# EAGLE design 1ssrCompactBoard (EAGLE 7.5.0)
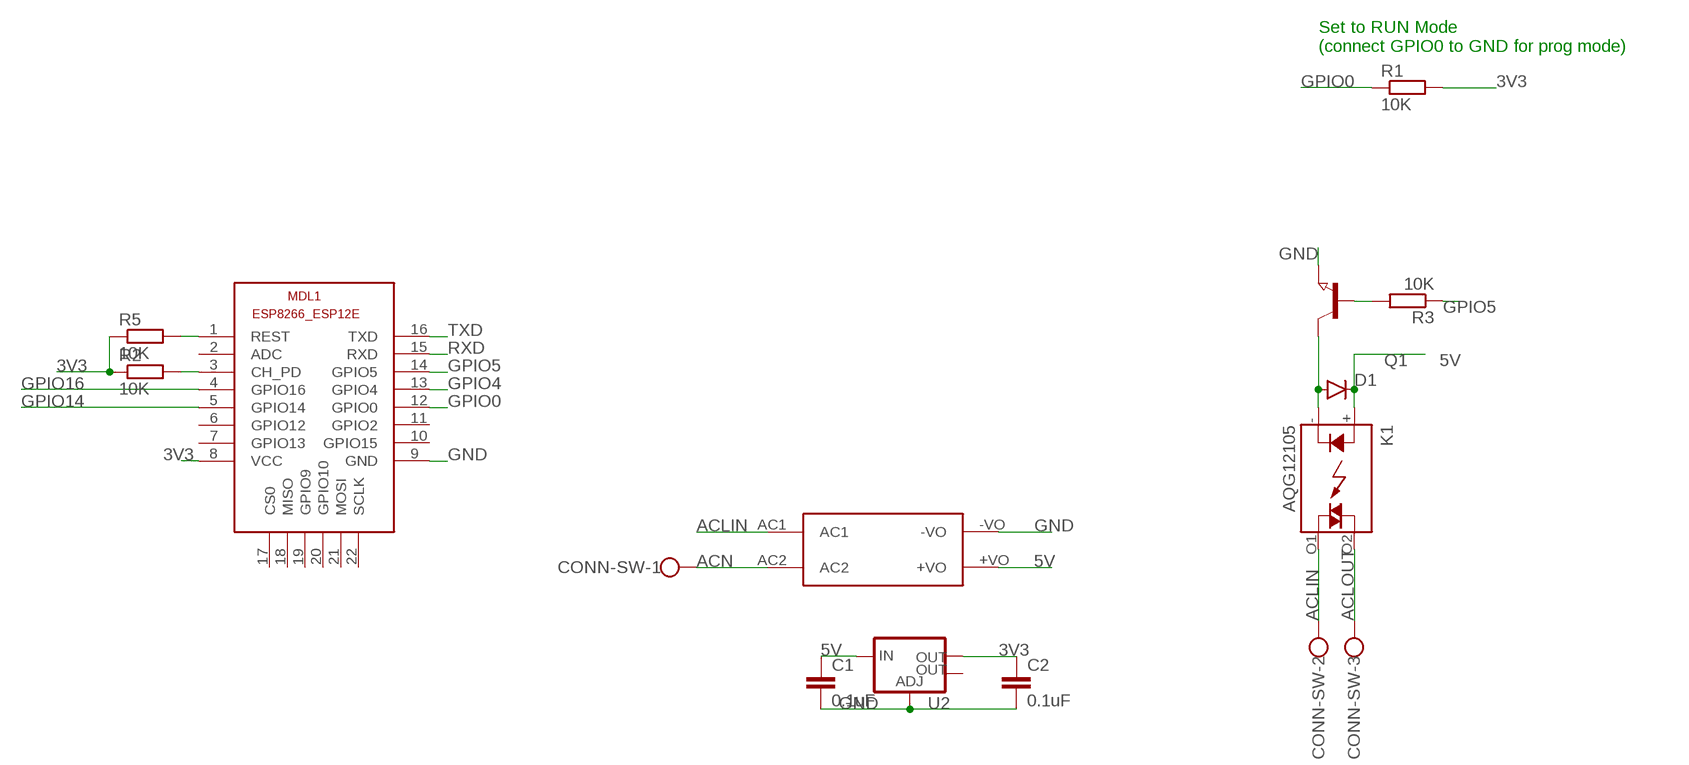
[diagram p0: schematic, sheet 1]

## Parts
C1  0.1uF  0.1UF-25V-5%(0603)  [0603-CAP]
C2  0.1uF  0.1UF-25V-5%(0603)  [0603-CAP]
CONN-SW  W237-103  [W237-103]
D1  DIODESMA  [SMA-DIODE]
K1  AQG12105  [AQG]
MDL1  ESP8266-12EESP8266-ESP12E  [ESP8266-ESP12E]
Q1  NPN-TRANSISTOR_SOT23  [SOT23]
R1  10K  R-EU_R0805  [R0805]
R2  10K  R-EU_R0805  [R0805]
R3  10K  R-EU_R0805  [R0805]
R5  10K  R-EU_R0805  [R0805]
U2  V_REG_LM1117SOT223  [SOT223]
U$4  HLK-PM01  [HLK-PM01]

## Nets
3V3: C2.1 MDL1.8(VCC) R1.2 R2.1 R5.1 U2.2(OUT)
5V: C1.1 D1.C K1.+(A) U2.3(IN) U$4.+VO
ACLIN [ac]: CONN-SW.2 K1.O1(DS2) U$4.AC1
ACLOUT [ac]: CONN-SW.3 K1.O2(DS1)
ACN [ac]: CONN-SW.1 U$4.AC2
GND: C1.2 C2.2 MDL1.9(GND) Q1.2(E) U2.1(ADJ) U$4.-VO
GPIO0: MDL1.12(GPIO0) R1.1
GPIO4: MDL1.13(GPIO4)
GPIO5: MDL1.14(GPIO5) R3.1
GPIO14: MDL1.5(GPIO14)
GPIO16: MDL1.4(GPIO16)
N$6: MDL1.1(REST) R5.2
N$9: MDL1.3(CH_PD) R2.2
N$10: D1.A K1.-(K) Q1.3(C)
N$12: Q1.1(B) R3.2
RXD: MDL1.15(RXD)
TXD: MDL1.16(TXD)
Unconnected: MDL1.2(ADC) MDL1.6(GPIO12) MDL1.7(GPIO13) MDL1.10(GPIO15) MDL1.11(GPIO2) MDL1.17(CS0) MDL1.18(MISO) MDL1.19(GPIO9) MDL1.20(GPIO10) MDL1.21(MOSI) MDL1.22(SCLK) U2.4(OUT)

## Notes on the sheet
- Set to RUN Mode
  (connect GPIO0 to GND for prog mode)

## Library data of the parts
C1 C2 = SparkFun-Capacitors:0.1UF-25V-5%(0603): CAP-08604; PROD_ID: CAP-08604
CONN-SW = con-wago-500:W237-103: WAGO SCREW CLAMP; MPN: 237-103; OC_FARNELL: unknown; OC_NEWARK: 18M7116
D1 = SparkFun-DiscreteSemi:DIODE: Diode These are standard reverse protection diodes and small signal diodes. SMA package can handle up to about 1A. SOD-323 can handle about 200mA. What the SOD-323 package when ordering, there are some mfgs out there that are 5-pin packages.
K1 = relay:AQG*: SOLID STATE RELAY NAiS Zero-cross, Non zero-cross Source: http://www.mew-europe.com/.. en_ds_61611_0000.pdf; MF: AROMAT/ MATSUSHITA; MPN: AQG12105; OC_FARNELL: unknown; OC_NEWARK: 20J4759
MDL1 = ESP8266-ESP12E:ESP8266-12E: ESP8266-12E with additional I/O and GPIO04/05 corrected The author cannot warrant that this library is free from error or will meet your specific requirements. Created by PuceBaboon.com. Komagane, Nagano, JAPAN
Q1 = semicon-smd-ipc:NPN-TRANSISTOR_: NPN TRANSISTOR
R1-R3 R5 = resistor:R-EU_: RESISTOR, European symbol
U2 = SparkFun-PowerIC:V_REG_LM1117: Voltage Regulator LM1117 Standard adjustable voltage regulator but in SMD form. Spark Fun Electronics SKU : COM-00595; PROD_ID: VREG-08170
U$4 = hlk-pm01:HLK-PM01

## Net classes
0 default: width 0.152 mm, drill 0.305 mm, clearance 0.152 mm
1 ac: width 1.27 mm, drill 1.27 mm, clearance 2.54 mm

## Board
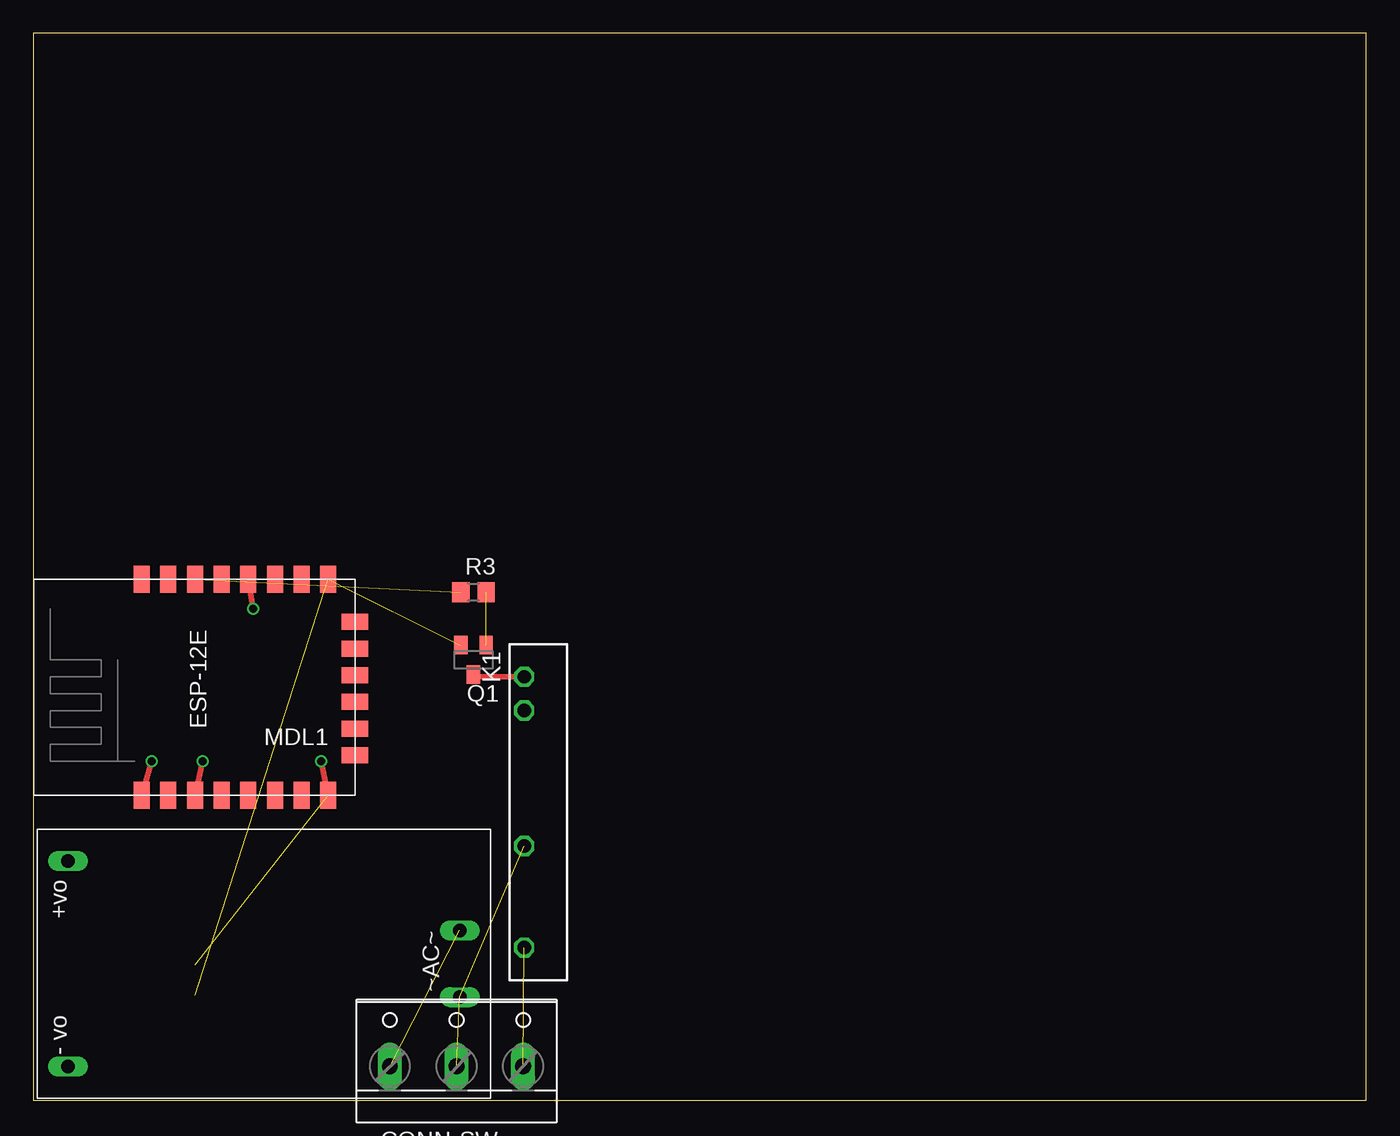
[diagram p1: board, top side]
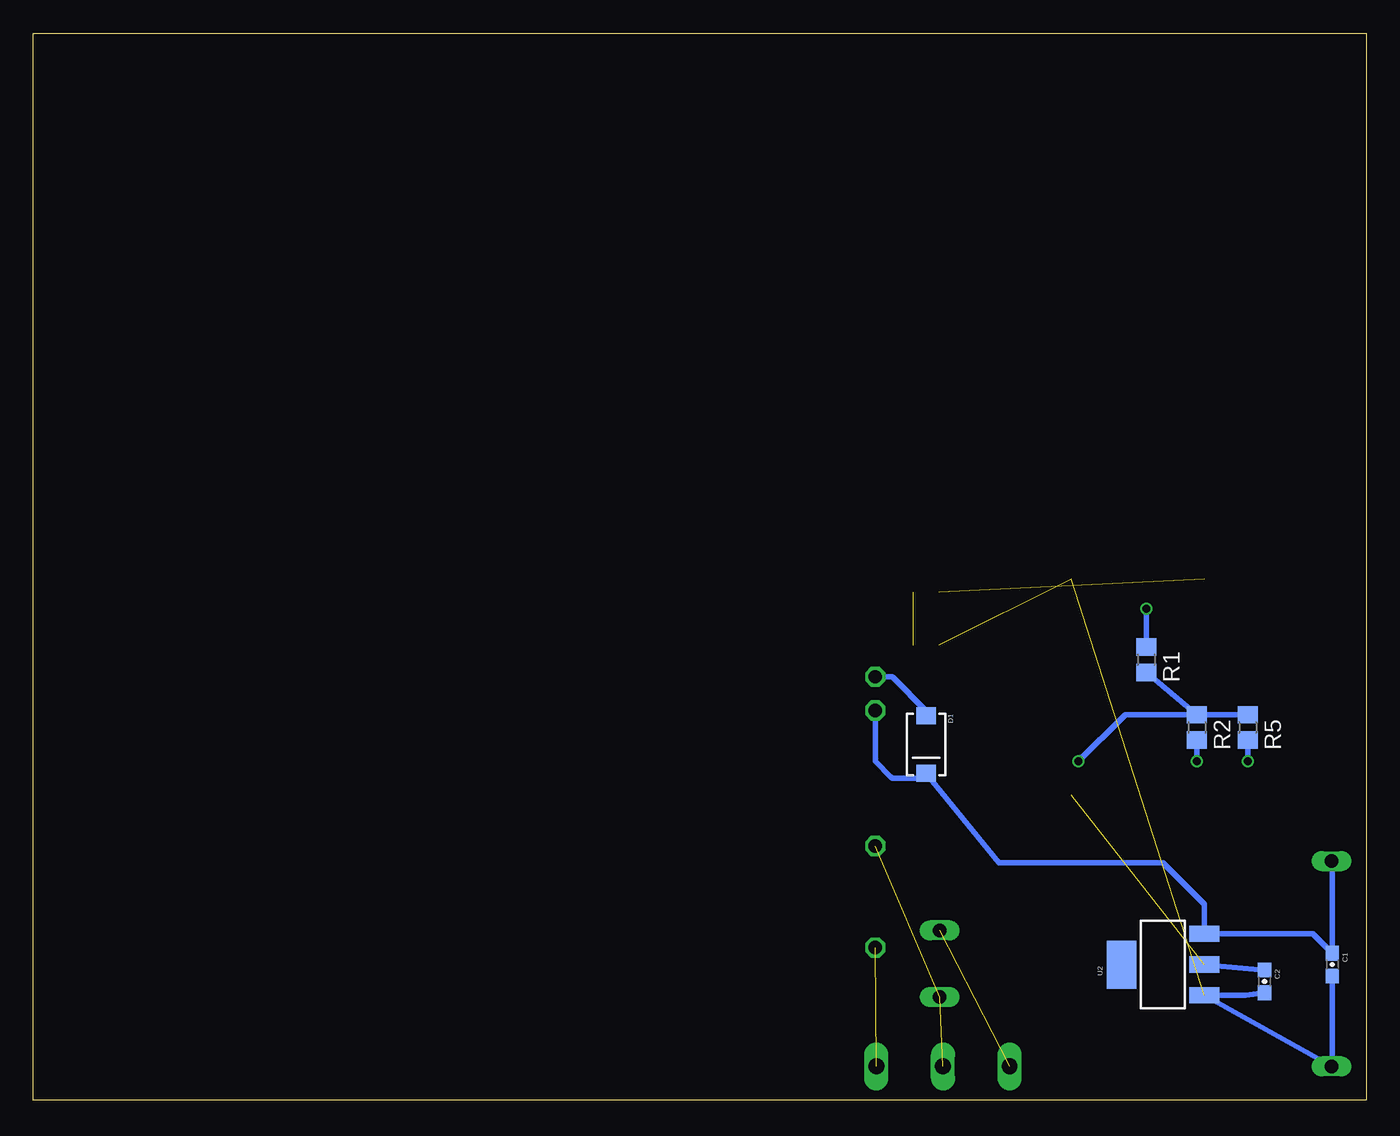
[diagram p2: board, bottom side, seen from below]

Size 100 x 80 mm. Coordinates in mm from the lower left corner, seen from the top.
Outline: 0,0 100,0 100,80 0,80 0,0
Copper layers (1*16): Top 0.035mm / dielectric 1.5mm / Bottom 0.035mm
Design rules "ShenZhen2U EagleRules": minimum track width 7mil, minimum drill 12mil, track to track 7mil, track to pad 7mil, pad to pad 7mil, via to via 7mil, smd to smd 0mil, copper to edge 20mil, drill to drill 10mil, minimum pad ring 10mil, minimum via ring 6mil, stop-mask expansion 2mil, vias tented up to drill 25mil, thermal gap 10mil

### Footprints (pad centres in the part's own frame; a part is rotated, then mirrored left to right if it is on the bottom)
0603-CAP = smd 1.1 x 1: 1 -0.85,0; 2 0.85,0
W237-103 = drill 1.194 long: 1 -5,-1.29; 2 0,-1.29; 3 5,-1.29
SMA-DIODE = smd 1.27 x 1.47: A -2.15,0; C 2.15,0
AQG = drill 1 octagon: + -7.62,0; - -10.16,0; O1 2.54,0; O2 10.16,0
ESP8266-ESP12E = smd 2 x 1.2: 1 0,16; 2 0,14; 3 0,12; 4 0,10; 5 0,8; 6 0,6; 7 0,4; 8 0,2; 9 16.2,2; 10 16.2,4; 11 16.2,6; 12 16.2,8; 13 16.2,10; 14 16.2,12; 15 16.2,14; 16 16.2,16 | smd 1.2 x 2: 17 11,0; 18 3,0; 19 5,0; 20 13,0; 21 7,0; 22 9,0
SOT23 = smd 1 x 1.4: 1 -0.95,-1.1; 2 0.95,-1.1; 3 0,1.1
R0805 = smd 1.3 x 1.5: 1 -0.95,0; 2 0.95,0
SOT223 = smd 1.219 x 2.235: 1 -2.311,-3.099; 2 0,-3.099; 3 2.311,-3.099 | smd 3.6 x 2.2: 4 0,3.099
HLK-PM01 = drill 1 long: +VO 31.7,2.4; -VO 31.7,17.8; AC1 2.3,12.6; AC2 2.3,7.6

### Placement (x,y rotation side)
C1  2.54,10.16 270 bottom
C2  7.62,8.89 270 bottom
CONN-SW  31.75,3.81 0 top
D1  33.02,26.67 270 bottom
K1  36.83,21.59 270 top
MDL1  24.13,22.86 90 top
Q1  33.02,33.02 180 top
R1  16.51,33.02 270 bottom
R2  12.7,27.94 270 bottom
R3  33.02,38.1 0 top
R5  8.89,27.94 270 bottom
U2  15.24,10.16 90 bottom
U$4  34.29,20.32 180 top

### Tracks (layer width: path | path; a pad name or v marks a point on that pad's centre or on a via)
3V3  (via drill 0.6)  (1 unrouted)
  Top 0.406: MDL1.8 v21.59,25.4
  Bottom 0.406: U2.2 C2.1 | R2.1 R5.1 | R1.2 R2.1 | v21.59,25.4 18.19,28.8 arc45 17.97,28.89 R2.1
5V
  Bottom 0.406: U$4.+VO 2.54,17.92 C1.1 4,12.47 U2.3 12.14,14.68 15.24,17.78 27.55,17.78 D1.C 33.02,24.13 35.43,24.13 arc45 35.65,24.22 36.83,25.4 K1.+
ACLIN  (2 unrouted)
ACLOUT  (1 unrouted)
ACN  (1 unrouted)
GND  (2 unrouted)
  Bottom 0.406: C1.2 2.54,2.52 U$4.-VO U2.1 9.08,7.85 C2.2
GPIO0  (via drill 0.6)
  Top 0.406: MDL1.12 v16.51,36.83
  Bottom 0.406: v16.51,36.83 R1.1
GPIO5  (1 unrouted)
N$6  (via drill 0.6)
  Top 0.406: MDL1.1 v8.89,25.4
  Bottom 0.406: v8.89,25.4 R5.2
N$9  (via drill 0.6)
  Top 0.406: MDL1.3 v12.7,25.4
  Bottom 0.406: v12.7,25.4 R2.2
N$10
  Top 0.406: Q1.3 33.1,31.84 arc45 33.32,31.75 K1.-
  Bottom 0.406: D1.A 33.02,29.21 35.47,31.66 arc-45 35.69,31.75 K1.-
N$12  (1 unrouted)